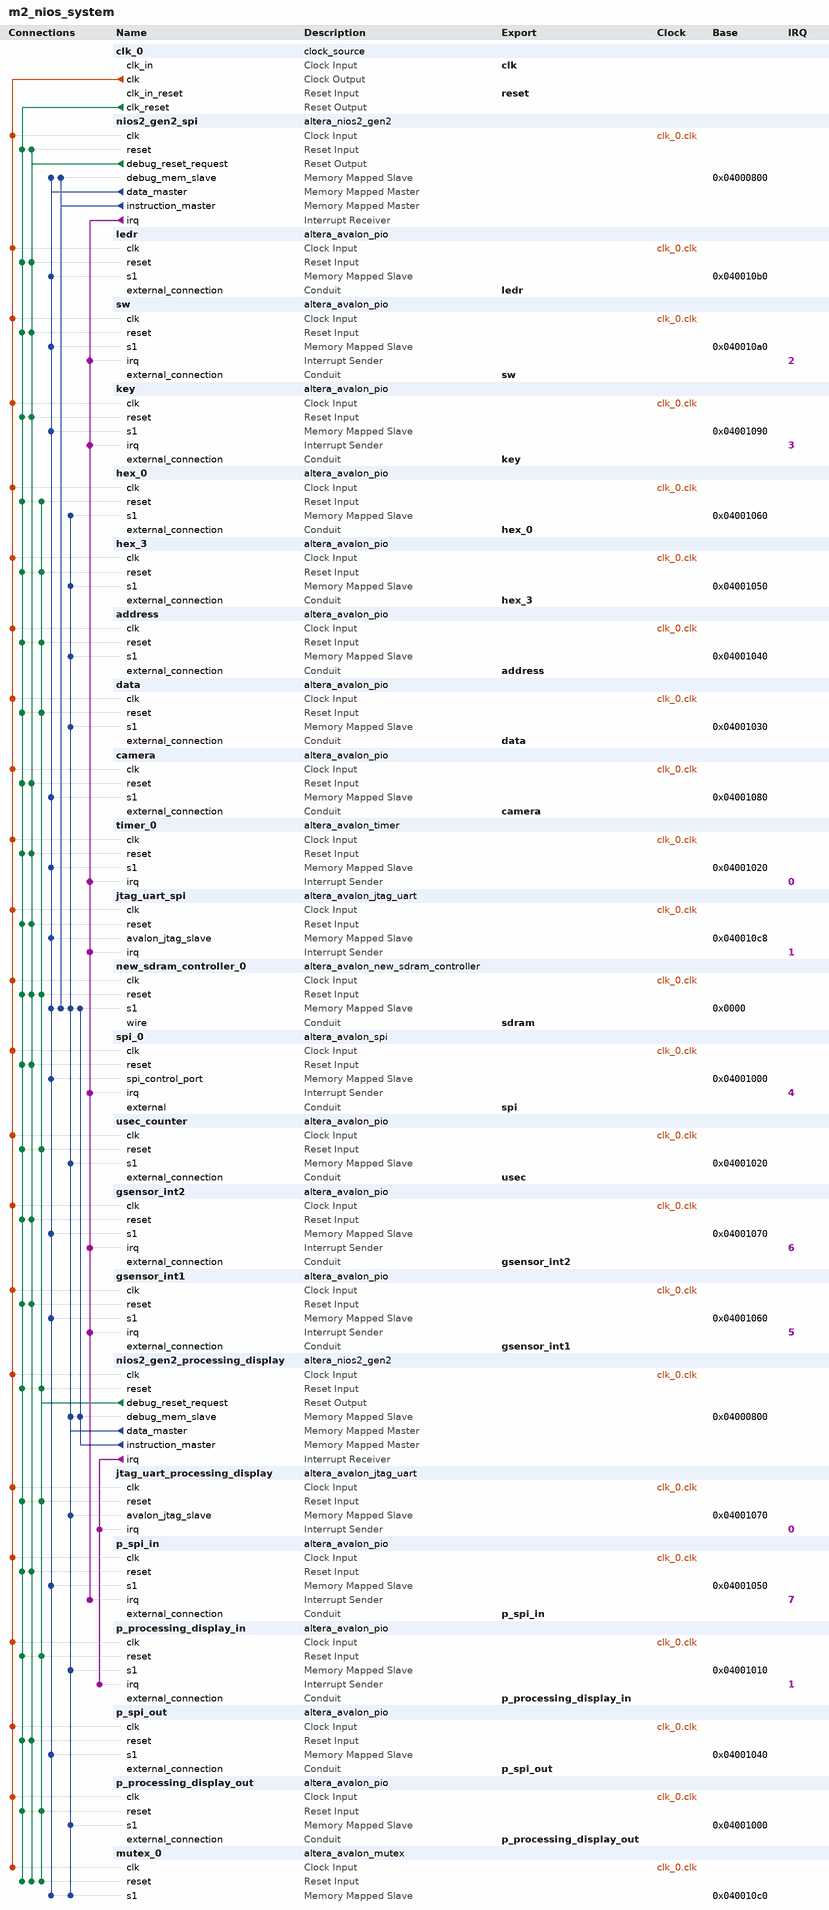
[diagram p0: system contents]
# Platform Designer (Qsys) system m2_nios_system, MAX 10 10M50DAF484C7G
# Parameters at their usual value, and those the tool derives, are not listed.
package require -exact qsys 18.1
create_system m2_nios_system
set_project_property DEVICE_FAMILY {MAX 10}
set_project_property DEVICE 10M50DAF484C7G

add_instance clk_0 clock_source 18.1
set_instance_parameter_value clk_0 clockFrequency 50000000

add_instance nios2_gen2_spi altera_nios2_gen2 18.1
set_instance_parameter_value nios2_gen2_spi dcache_size 2048
set_instance_parameter_value nios2_gen2_spi exceptionSlave new_sdram_controller_0.s1
set_instance_parameter_value nios2_gen2_spi icache_size 4096
set_instance_parameter_value nios2_gen2_spi impl Fast
set_instance_parameter_value nios2_gen2_spi resetSlave new_sdram_controller_0.s1

add_instance ledr altera_avalon_pio 18.1
set_instance_parameter_value ledr direction Output
set_instance_parameter_value ledr width 10

add_instance sw altera_avalon_pio 18.1
set_instance_parameter_value sw captureEdge true
set_instance_parameter_value sw direction Input
set_instance_parameter_value sw generateIRQ true
set_instance_parameter_value sw irqType EDGE
set_instance_parameter_value sw width 10

add_instance key altera_avalon_pio 18.1
set_instance_parameter_value key captureEdge true
set_instance_parameter_value key direction Input
set_instance_parameter_value key generateIRQ true
set_instance_parameter_value key irqType EDGE
set_instance_parameter_value key width 2

add_instance hex_0 altera_avalon_pio 18.1
set_instance_parameter_value hex_0 direction Output
set_instance_parameter_value hex_0 width 24

add_instance hex_3 altera_avalon_pio 18.1
set_instance_parameter_value hex_3 direction Output
set_instance_parameter_value hex_3 width 24

add_instance address altera_avalon_pio 18.1
set_instance_parameter_value address direction Output
set_instance_parameter_value address width 17

add_instance data altera_avalon_pio 18.1
set_instance_parameter_value data direction Output
set_instance_parameter_value data width 4

add_instance camera altera_avalon_pio 18.1
set_instance_parameter_value camera direction Input
set_instance_parameter_value camera width 1

add_instance timer_0 altera_avalon_timer 18.1
set_instance_parameter_value timer_0 period 1
set_instance_parameter_value timer_0 periodUnits MSEC

add_instance jtag_uart_spi altera_avalon_jtag_uart 18.1
set_instance_parameter_value jtag_uart_spi simInteractiveOptions NO_INTERACTIVE_WINDOWS

add_instance new_sdram_controller_0 altera_avalon_new_sdram_controller 18.1
set_instance_parameter_value new_sdram_controller_0 TAC 5.5
set_instance_parameter_value new_sdram_controller_0 TRCD 20.0
set_instance_parameter_value new_sdram_controller_0 TRP 20.0
set_instance_parameter_value new_sdram_controller_0 casLatency 3
set_instance_parameter_value new_sdram_controller_0 columnWidth 10
set_instance_parameter_value new_sdram_controller_0 dataWidth 16
set_instance_parameter_value new_sdram_controller_0 generateSimulationModel false
set_instance_parameter_value new_sdram_controller_0 model single_Micron_MT48LC4M32B2_7_chip
set_instance_parameter_value new_sdram_controller_0 numberOfBanks 4
set_instance_parameter_value new_sdram_controller_0 numberOfChipSelects 1
set_instance_parameter_value new_sdram_controller_0 powerUpDelay 100.0
set_instance_parameter_value new_sdram_controller_0 refreshPeriod 15.625
set_instance_parameter_value new_sdram_controller_0 rowWidth 13

add_instance spi_0 altera_avalon_spi 18.1
set_instance_parameter_value spi_0 clockPhase 1
set_instance_parameter_value spi_0 clockPolarity 1
set_instance_parameter_value spi_0 dataWidth 8
set_instance_parameter_value spi_0 masterSPI true
set_instance_parameter_value spi_0 numberOfSlaves 2
set_instance_parameter_value spi_0 targetClockRate 5000000

add_instance usec_counter altera_avalon_pio 18.1
set_instance_parameter_value usec_counter direction Input
set_instance_parameter_value usec_counter width 32

add_instance gsensor_int2 altera_avalon_pio 18.1
set_instance_parameter_value gsensor_int2 captureEdge true
set_instance_parameter_value gsensor_int2 direction Input
set_instance_parameter_value gsensor_int2 generateIRQ true
set_instance_parameter_value gsensor_int2 irqType EDGE
set_instance_parameter_value gsensor_int2 width 1

add_instance gsensor_int1 altera_avalon_pio 18.1
set_instance_parameter_value gsensor_int1 captureEdge true
set_instance_parameter_value gsensor_int1 direction Input
set_instance_parameter_value gsensor_int1 generateIRQ true
set_instance_parameter_value gsensor_int1 irqType EDGE
set_instance_parameter_value gsensor_int1 width 1

add_instance nios2_gen2_processing_display altera_nios2_gen2 18.1
set_instance_parameter_value nios2_gen2_processing_display cpuID 1
set_instance_parameter_value nios2_gen2_processing_display dcache_size 2048
set_instance_parameter_value nios2_gen2_processing_display exceptionOffset 16777248
set_instance_parameter_value nios2_gen2_processing_display exceptionSlave new_sdram_controller_0.s1
set_instance_parameter_value nios2_gen2_processing_display icache_size 4096
set_instance_parameter_value nios2_gen2_processing_display impl Fast
set_instance_parameter_value nios2_gen2_processing_display resetOffset 16777216
set_instance_parameter_value nios2_gen2_processing_display resetSlave new_sdram_controller_0.s1

add_instance jtag_uart_processing_display altera_avalon_jtag_uart 18.1
set_instance_parameter_value jtag_uart_processing_display simInteractiveOptions NO_INTERACTIVE_WINDOWS

add_instance p_spi_in altera_avalon_pio 18.1
set_instance_parameter_value p_spi_in captureEdge true
set_instance_parameter_value p_spi_in direction Input
set_instance_parameter_value p_spi_in generateIRQ true
set_instance_parameter_value p_spi_in irqType EDGE
set_instance_parameter_value p_spi_in width 1

add_instance p_processing_display_in altera_avalon_pio 18.1
set_instance_parameter_value p_processing_display_in captureEdge true
set_instance_parameter_value p_processing_display_in direction Input
set_instance_parameter_value p_processing_display_in generateIRQ true
set_instance_parameter_value p_processing_display_in irqType EDGE
set_instance_parameter_value p_processing_display_in width 1

add_instance p_spi_out altera_avalon_pio 18.1
set_instance_parameter_value p_spi_out direction Output
set_instance_parameter_value p_spi_out width 1

add_instance p_processing_display_out altera_avalon_pio 18.1
set_instance_parameter_value p_processing_display_out direction Output
set_instance_parameter_value p_processing_display_out width 1

add_instance mutex_0 altera_avalon_mutex 18.1

# connections
add_connection clk_0.clk address.clk clock
add_connection clk_0.clk camera.clk clock
add_connection clk_0.clk data.clk clock
add_connection clk_0.clk gsensor_int1.clk clock
add_connection clk_0.clk gsensor_int2.clk clock
add_connection clk_0.clk hex_0.clk clock
add_connection clk_0.clk hex_3.clk clock
add_connection clk_0.clk jtag_uart_processing_display.clk clock
add_connection clk_0.clk jtag_uart_spi.clk clock
add_connection clk_0.clk key.clk clock
add_connection clk_0.clk ledr.clk clock
add_connection clk_0.clk mutex_0.clk clock
add_connection clk_0.clk new_sdram_controller_0.clk clock
add_connection clk_0.clk nios2_gen2_processing_display.clk clock
add_connection clk_0.clk nios2_gen2_spi.clk clock
add_connection clk_0.clk p_processing_display_in.clk clock
add_connection clk_0.clk p_processing_display_out.clk clock
add_connection clk_0.clk p_spi_in.clk clock
add_connection clk_0.clk p_spi_out.clk clock
add_connection clk_0.clk spi_0.clk clock
add_connection clk_0.clk sw.clk clock
add_connection clk_0.clk timer_0.clk clock
add_connection clk_0.clk usec_counter.clk clock
add_connection clk_0.clk_reset address.reset reset
add_connection clk_0.clk_reset camera.reset reset
add_connection clk_0.clk_reset data.reset reset
add_connection clk_0.clk_reset gsensor_int1.reset reset
add_connection clk_0.clk_reset gsensor_int2.reset reset
add_connection clk_0.clk_reset hex_0.reset reset
add_connection clk_0.clk_reset hex_3.reset reset
add_connection clk_0.clk_reset jtag_uart_processing_display.reset reset
add_connection clk_0.clk_reset jtag_uart_spi.reset reset
add_connection clk_0.clk_reset key.reset reset
add_connection clk_0.clk_reset ledr.reset reset
add_connection clk_0.clk_reset mutex_0.reset reset
add_connection clk_0.clk_reset new_sdram_controller_0.reset reset
add_connection clk_0.clk_reset nios2_gen2_processing_display.reset reset
add_connection clk_0.clk_reset nios2_gen2_spi.reset reset
add_connection clk_0.clk_reset p_processing_display_in.reset reset
add_connection clk_0.clk_reset p_processing_display_out.reset reset
add_connection clk_0.clk_reset p_spi_in.reset reset
add_connection clk_0.clk_reset p_spi_out.reset reset
add_connection clk_0.clk_reset spi_0.reset reset
add_connection clk_0.clk_reset sw.reset reset
add_connection clk_0.clk_reset timer_0.reset reset
add_connection clk_0.clk_reset usec_counter.reset reset
add_connection nios2_gen2_processing_display.debug_reset_request address.reset reset
add_connection nios2_gen2_processing_display.debug_reset_request data.reset reset
add_connection nios2_gen2_processing_display.debug_reset_request hex_0.reset reset
add_connection nios2_gen2_processing_display.debug_reset_request hex_3.reset reset
add_connection nios2_gen2_processing_display.debug_reset_request jtag_uart_processing_display.reset reset
add_connection nios2_gen2_processing_display.debug_reset_request mutex_0.reset reset
add_connection nios2_gen2_processing_display.debug_reset_request new_sdram_controller_0.reset reset
add_connection nios2_gen2_processing_display.debug_reset_request nios2_gen2_processing_display.reset reset
add_connection nios2_gen2_processing_display.debug_reset_request p_processing_display_in.reset reset
add_connection nios2_gen2_processing_display.debug_reset_request p_processing_display_out.reset reset
add_connection nios2_gen2_processing_display.debug_reset_request usec_counter.reset reset
add_connection nios2_gen2_spi.debug_reset_request camera.reset reset
add_connection nios2_gen2_spi.debug_reset_request gsensor_int1.reset reset
add_connection nios2_gen2_spi.debug_reset_request gsensor_int2.reset reset
add_connection nios2_gen2_spi.debug_reset_request jtag_uart_spi.reset reset
add_connection nios2_gen2_spi.debug_reset_request key.reset reset
add_connection nios2_gen2_spi.debug_reset_request ledr.reset reset
add_connection nios2_gen2_spi.debug_reset_request mutex_0.reset reset
add_connection nios2_gen2_spi.debug_reset_request new_sdram_controller_0.reset reset
add_connection nios2_gen2_spi.debug_reset_request nios2_gen2_spi.reset reset
add_connection nios2_gen2_spi.debug_reset_request p_spi_in.reset reset
add_connection nios2_gen2_spi.debug_reset_request p_spi_out.reset reset
add_connection nios2_gen2_spi.debug_reset_request spi_0.reset reset
add_connection nios2_gen2_spi.debug_reset_request sw.reset reset
add_connection nios2_gen2_spi.debug_reset_request timer_0.reset reset
add_connection nios2_gen2_processing_display.data_master address.s1 avalon
set_connection_parameter_value nios2_gen2_processing_display.data_master/address.s1 baseAddress 0x04001040
add_connection nios2_gen2_processing_display.data_master data.s1 avalon
set_connection_parameter_value nios2_gen2_processing_display.data_master/data.s1 baseAddress 0x04001030
add_connection nios2_gen2_processing_display.data_master hex_0.s1 avalon
set_connection_parameter_value nios2_gen2_processing_display.data_master/hex_0.s1 baseAddress 0x04001060
add_connection nios2_gen2_processing_display.data_master hex_3.s1 avalon
set_connection_parameter_value nios2_gen2_processing_display.data_master/hex_3.s1 baseAddress 0x04001050
add_connection nios2_gen2_processing_display.data_master jtag_uart_processing_display.avalon_jtag_slave avalon
set_connection_parameter_value nios2_gen2_processing_display.data_master/jtag_uart_processing_display.avalon_jtag_slave baseAddress 0x04001070
add_connection nios2_gen2_processing_display.data_master mutex_0.s1 avalon
set_connection_parameter_value nios2_gen2_processing_display.data_master/mutex_0.s1 baseAddress 0x040010c0
add_connection nios2_gen2_processing_display.data_master new_sdram_controller_0.s1 avalon
set_connection_parameter_value nios2_gen2_processing_display.data_master/new_sdram_controller_0.s1 baseAddress 0x0000
add_connection nios2_gen2_processing_display.data_master nios2_gen2_processing_display.debug_mem_slave avalon
set_connection_parameter_value nios2_gen2_processing_display.data_master/nios2_gen2_processing_display.debug_mem_slave baseAddress 0x04000800
add_connection nios2_gen2_processing_display.data_master p_processing_display_in.s1 avalon
set_connection_parameter_value nios2_gen2_processing_display.data_master/p_processing_display_in.s1 baseAddress 0x04001010
add_connection nios2_gen2_processing_display.data_master p_processing_display_out.s1 avalon
set_connection_parameter_value nios2_gen2_processing_display.data_master/p_processing_display_out.s1 baseAddress 0x04001000
add_connection nios2_gen2_processing_display.data_master usec_counter.s1 avalon
set_connection_parameter_value nios2_gen2_processing_display.data_master/usec_counter.s1 baseAddress 0x04001020
add_connection nios2_gen2_processing_display.instruction_master new_sdram_controller_0.s1 avalon
set_connection_parameter_value nios2_gen2_processing_display.instruction_master/new_sdram_controller_0.s1 baseAddress 0x0000
add_connection nios2_gen2_processing_display.instruction_master nios2_gen2_processing_display.debug_mem_slave avalon
set_connection_parameter_value nios2_gen2_processing_display.instruction_master/nios2_gen2_processing_display.debug_mem_slave baseAddress 0x04000800
add_connection nios2_gen2_spi.data_master camera.s1 avalon
set_connection_parameter_value nios2_gen2_spi.data_master/camera.s1 baseAddress 0x04001080
add_connection nios2_gen2_spi.data_master gsensor_int1.s1 avalon
set_connection_parameter_value nios2_gen2_spi.data_master/gsensor_int1.s1 baseAddress 0x04001060
add_connection nios2_gen2_spi.data_master gsensor_int2.s1 avalon
set_connection_parameter_value nios2_gen2_spi.data_master/gsensor_int2.s1 baseAddress 0x04001070
add_connection nios2_gen2_spi.data_master jtag_uart_spi.avalon_jtag_slave avalon
set_connection_parameter_value nios2_gen2_spi.data_master/jtag_uart_spi.avalon_jtag_slave baseAddress 0x040010c8
add_connection nios2_gen2_spi.data_master key.s1 avalon
set_connection_parameter_value nios2_gen2_spi.data_master/key.s1 baseAddress 0x04001090
add_connection nios2_gen2_spi.data_master ledr.s1 avalon
set_connection_parameter_value nios2_gen2_spi.data_master/ledr.s1 baseAddress 0x040010b0
add_connection nios2_gen2_spi.data_master mutex_0.s1 avalon
set_connection_parameter_value nios2_gen2_spi.data_master/mutex_0.s1 baseAddress 0x040010c0
add_connection nios2_gen2_spi.data_master new_sdram_controller_0.s1 avalon
set_connection_parameter_value nios2_gen2_spi.data_master/new_sdram_controller_0.s1 baseAddress 0x0000
add_connection nios2_gen2_spi.data_master nios2_gen2_spi.debug_mem_slave avalon
set_connection_parameter_value nios2_gen2_spi.data_master/nios2_gen2_spi.debug_mem_slave baseAddress 0x04000800
add_connection nios2_gen2_spi.data_master p_spi_in.s1 avalon
set_connection_parameter_value nios2_gen2_spi.data_master/p_spi_in.s1 baseAddress 0x04001050
add_connection nios2_gen2_spi.data_master p_spi_out.s1 avalon
set_connection_parameter_value nios2_gen2_spi.data_master/p_spi_out.s1 baseAddress 0x04001040
add_connection nios2_gen2_spi.data_master spi_0.spi_control_port avalon
set_connection_parameter_value nios2_gen2_spi.data_master/spi_0.spi_control_port baseAddress 0x04001000
add_connection nios2_gen2_spi.data_master sw.s1 avalon
set_connection_parameter_value nios2_gen2_spi.data_master/sw.s1 baseAddress 0x040010a0
add_connection nios2_gen2_spi.data_master timer_0.s1 avalon
set_connection_parameter_value nios2_gen2_spi.data_master/timer_0.s1 baseAddress 0x04001020
add_connection nios2_gen2_spi.instruction_master new_sdram_controller_0.s1 avalon
set_connection_parameter_value nios2_gen2_spi.instruction_master/new_sdram_controller_0.s1 baseAddress 0x0000
add_connection nios2_gen2_spi.instruction_master nios2_gen2_spi.debug_mem_slave avalon
set_connection_parameter_value nios2_gen2_spi.instruction_master/nios2_gen2_spi.debug_mem_slave baseAddress 0x04000800
add_connection nios2_gen2_processing_display.irq jtag_uart_processing_display.irq interrupt
set_connection_parameter_value nios2_gen2_processing_display.irq/jtag_uart_processing_display.irq irqNumber 0
add_connection nios2_gen2_processing_display.irq p_processing_display_in.irq interrupt
set_connection_parameter_value nios2_gen2_processing_display.irq/p_processing_display_in.irq irqNumber 1
add_connection nios2_gen2_spi.irq gsensor_int1.irq interrupt
set_connection_parameter_value nios2_gen2_spi.irq/gsensor_int1.irq irqNumber 5
add_connection nios2_gen2_spi.irq gsensor_int2.irq interrupt
set_connection_parameter_value nios2_gen2_spi.irq/gsensor_int2.irq irqNumber 6
add_connection nios2_gen2_spi.irq jtag_uart_spi.irq interrupt
set_connection_parameter_value nios2_gen2_spi.irq/jtag_uart_spi.irq irqNumber 1
add_connection nios2_gen2_spi.irq key.irq interrupt
set_connection_parameter_value nios2_gen2_spi.irq/key.irq irqNumber 3
add_connection nios2_gen2_spi.irq p_spi_in.irq interrupt
set_connection_parameter_value nios2_gen2_spi.irq/p_spi_in.irq irqNumber 7
add_connection nios2_gen2_spi.irq spi_0.irq interrupt
set_connection_parameter_value nios2_gen2_spi.irq/spi_0.irq irqNumber 4
add_connection nios2_gen2_spi.irq sw.irq interrupt
set_connection_parameter_value nios2_gen2_spi.irq/sw.irq irqNumber 2
add_connection nios2_gen2_spi.irq timer_0.irq interrupt
set_connection_parameter_value nios2_gen2_spi.irq/timer_0.irq irqNumber 0

# exported interfaces
add_interface address conduit end
set_interface_property address EXPORT_OF address.external_connection
add_interface camera conduit end
set_interface_property camera EXPORT_OF camera.external_connection
add_interface clk clock sink
set_interface_property clk EXPORT_OF clk_0.clk_in
add_interface data conduit end
set_interface_property data EXPORT_OF data.external_connection
add_interface gsensor_int1 conduit end
set_interface_property gsensor_int1 EXPORT_OF gsensor_int1.external_connection
add_interface gsensor_int2 conduit end
set_interface_property gsensor_int2 EXPORT_OF gsensor_int2.external_connection
add_interface hex_0 conduit end
set_interface_property hex_0 EXPORT_OF hex_0.external_connection
add_interface hex_3 conduit end
set_interface_property hex_3 EXPORT_OF hex_3.external_connection
add_interface key conduit end
set_interface_property key EXPORT_OF key.external_connection
add_interface ledr conduit end
set_interface_property ledr EXPORT_OF ledr.external_connection
add_interface p_processing_display_in conduit end
set_interface_property p_processing_display_in EXPORT_OF p_processing_display_in.external_connection
add_interface p_processing_display_out conduit end
set_interface_property p_processing_display_out EXPORT_OF p_processing_display_out.external_connection
add_interface p_spi_in conduit end
set_interface_property p_spi_in EXPORT_OF p_spi_in.external_connection
add_interface p_spi_out conduit end
set_interface_property p_spi_out EXPORT_OF p_spi_out.external_connection
add_interface reset reset sink
set_interface_property reset EXPORT_OF clk_0.clk_in_reset
add_interface sdram conduit end
set_interface_property sdram EXPORT_OF new_sdram_controller_0.wire
add_interface spi conduit end
set_interface_property spi EXPORT_OF spi_0.external
add_interface sw conduit end
set_interface_property sw EXPORT_OF sw.external_connection
add_interface usec conduit end
set_interface_property usec EXPORT_OF usec_counter.external_connection

set_interconnect_requirement {$system} qsys_mm.clockCrossingAdapter HANDSHAKE
set_interconnect_requirement {$system} qsys_mm.enableEccProtection FALSE
set_interconnect_requirement {$system} qsys_mm.insertDefaultSlave FALSE
set_interconnect_requirement {$system} qsys_mm.maxAdditionalLatency 1

save_system m2_nios_system.qsys
